# Altium schematic sheet MSP430.SchDoc
size A; SheetNumber: roneV11-msp430; SheetTotal: 6
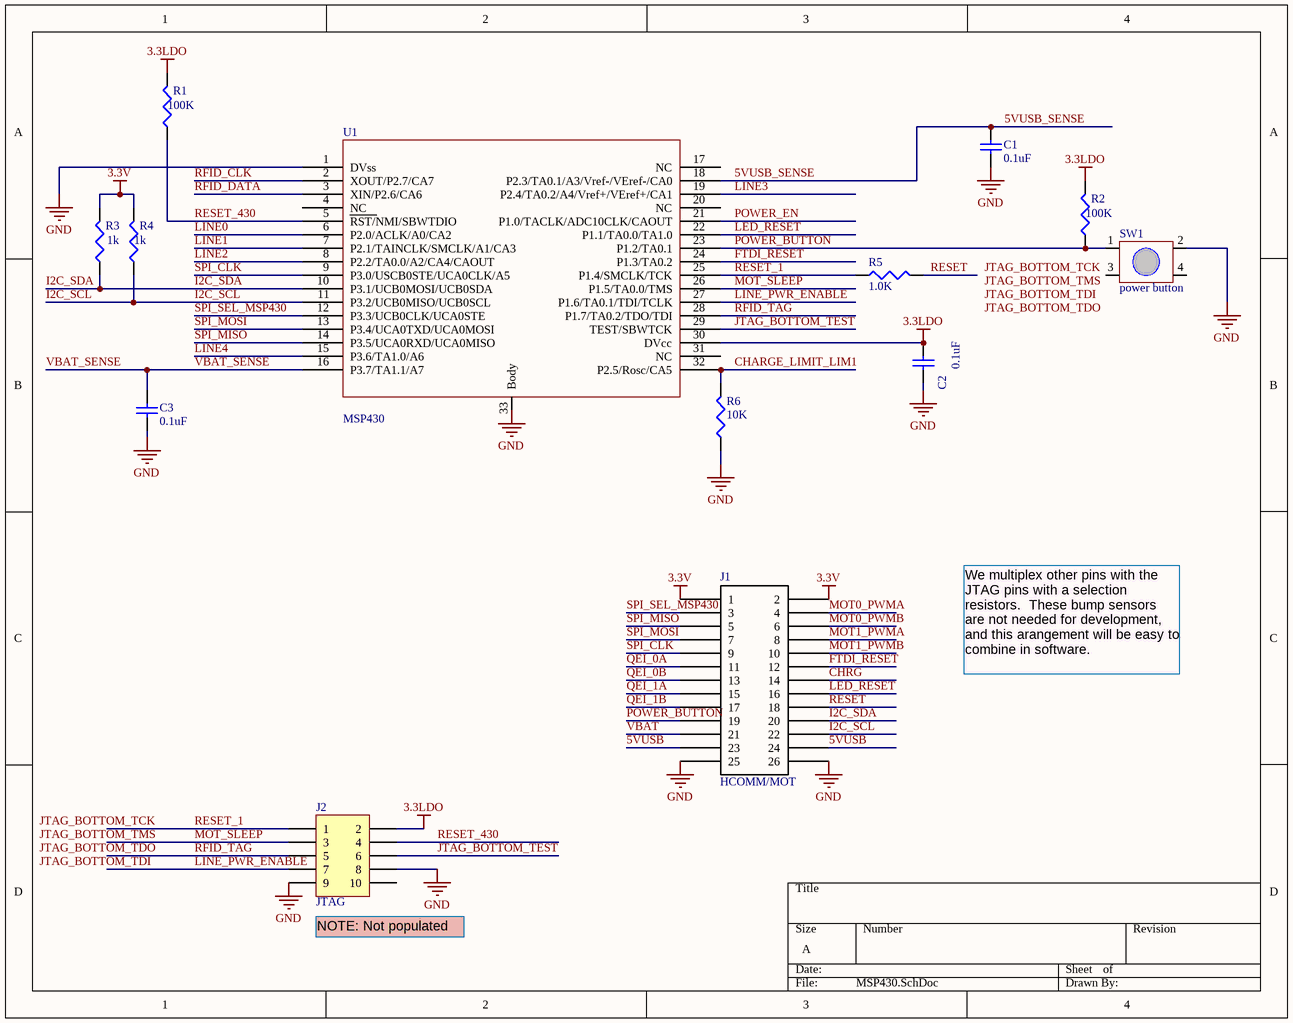
[diagram p0: MSP430.SchDoc]

## Parts
C1  value 0.1uF  [CAPC1005L]  (hidden comment: Cap Semi)
C2  value 0.1uF  [CAPC1005L]  (hidden comment: Cap Semi)
C3  value 0.1uF  [CAPC1005L]  (hidden comment: Cap Semi)
J1  HCOMM/MOT  [HeaderSM 13x2]
J2  JTAG  [HDR2X5]
R1  value 100K  [RESC1608L]  (hidden comment: Res3)
R2  value 100K  [RESC1608L]  (hidden comment: Res3)
R3  value 1k  [RESC1608L]  (hidden comment: Res3)
R4  value 1k  [RESC1608L]  (hidden comment: Res3)
R5  value 1.0K  [J1-0603]  (hidden comment: Res3)
R6  value 10K  [RESC1608L]  (hidden comment: Res3)
SW1  power button  [SwitchTall-TL330]
U1  MSP430  [MSP430_32PIN]

## Nets
3.3LDO: C2.2 J2.2 R1.2 R2.2 U1.30(DVcc)
3.3V: J1.1 J1.2 R3.2 R4.2
GND: C1.1 C2.1 C3.1 J1.25 J1.26 J2.8 J2.9 R6.1 SW1.2 U1.1(DVss) U1.33(Body)
5VUSB: J1.23 J1.24
5VUSB_SENSE: C1.2 U1.18(P2.3/TA0.1/A3/Vref-/VEref-/CA0)
CHARGE_LIMIT_LIM1: R6.2 U1.32(P2.5/Rosc/CA5)
CHRG: J1.14
FTDI_RESET: J1.12 U1.24(P1.3/TA0.2)
I2C_SCL: J1.22 R4.1 U1.11(P3.2/UCB0MISO/UCB0SCL)
I2C_SDA: J1.20 R3.1 U1.10(P3.1/UCB0MOSI/UCB0SDA)
JTAG_BOTTOM_TEST: J2.6 U1.29(TEST/SBWTCK)
LED_RESET: J1.16 U1.22(P1.1/TA0.0/TA1.0)
LINE0: U1.6(P2.0/ACLK/A0/CA2)
LINE1: U1.7(P2.1/TAINCLK/SMCLK/A1/CA3)
LINE2: U1.8(P2.2/TA0.0/A2/CA4/CAOUT)
LINE3: U1.19(P2.4/TA0.2/A4/Vref+/VEref+/CA1)
LINE4: U1.15(P3.6/TA1.0/A6)
LINE_PWR_ENABLE: J2.7 U1.27(P1.6/TA0.1/TDI/TCLK)
MOT0_PWMA: J1.4
MOT0_PWMB: J1.6
MOT1_PWMA: J1.8
MOT1_PWMB: J1.10
MOT_SLEEP: J2.3 U1.26(P1.5/TA0.0/TMS)
POWER_BUTTON: J1.19 R2.1 SW1.1 U1.23(P1.2/TA0.1)
POWER_EN: U1.21(P1.0/TACLK/ADC10CLK/CAOUT)
QEI_0A: J1.11
QEI_0B: J1.13
QEI_1A: J1.15
QEI_1B: J1.17
RESET: J1.18 R5.2
RESET_1: J2.1 R5.1 U1.25(P1.4/SMCLK/TCK)
RESET_430: J2.4 R1.1 U1.5(RST/NMI/SBWTDIO)
RFID_CLK: U1.2(XOUT/P2.7/CA7)
RFID_DATA: U1.3(XIN/P2.6/CA6)
RFID_TAG: J2.5 U1.28(P1.7/TA0.2/TDO/TDI)
SPI_CLK: J1.9 U1.9(P3.0/USCB0STE/UCA0CLK/A5)
SPI_MISO: J1.5 U1.14(P3.5/UCA0RXD/UCA0MISO)
SPI_MOSI: J1.7 U1.13(P3.4/UCA0TXD/UCA0MOSI)
SPI_SEL_MSP430: J1.3 U1.12(P3.3/UCB0CLK/UCA0STE)
VBAT: J1.21
VBAT_SENSE: C3.2 U1.16(P3.7/TA1.1/A7)

Not connected (* = marked no-connect by the designer): J2 10; SW1 3 4; U1 4(NC) 17(NC) 20(NC) 31(NC)

## Notes on the sheet
- We multiplex other pins with the JTAG pins with a selection resistors.  These bump sensors are not needed for development, and this arangement will be easy to combine in software.
- (near J2) NOTE: Not populated
- Labels drawn without touching a wire or pin: JTAG_BOTTOM_TCK, JTAG_BOTTOM_TDI, JTAG_BOTTOM_TDO, JTAG_BOTTOM_TMS

## Library data of the parts
C1-C3 = Cap Semi: Capacitor (Semiconductor SIM Model); Published: 8-Jun-2000; LatestRevisionDate: 29-May-2009; LatestRevisionNote: IPC-7351 Footprint Added.; PackageReference: C1206; Publisher: Altium Limited; PackageDescription: Chip Capacitor
J1 = HCOMM/HMOT: Header, 2X20, 50mil, IDC
J2 = Header 5X2: Header, 5-Pin, Dual row; LatestRevisionDate: 17-Jul-2002; LatestRevisionNote: Re-released for DXP Platform.; Publisher: Altium Limited
R1-R6 = Res3: Resistor; Published: 8-Jun-2000; LatestRevisionDate: 29-May-2009; LatestRevisionNote: IPC-7351 Footprint Added.; PackageReference: J1-0603; Publisher: Altium Limited; PackageDescription: Chip Resistor
SW1 = Switch-TL330
U1 = MSP430_32pin